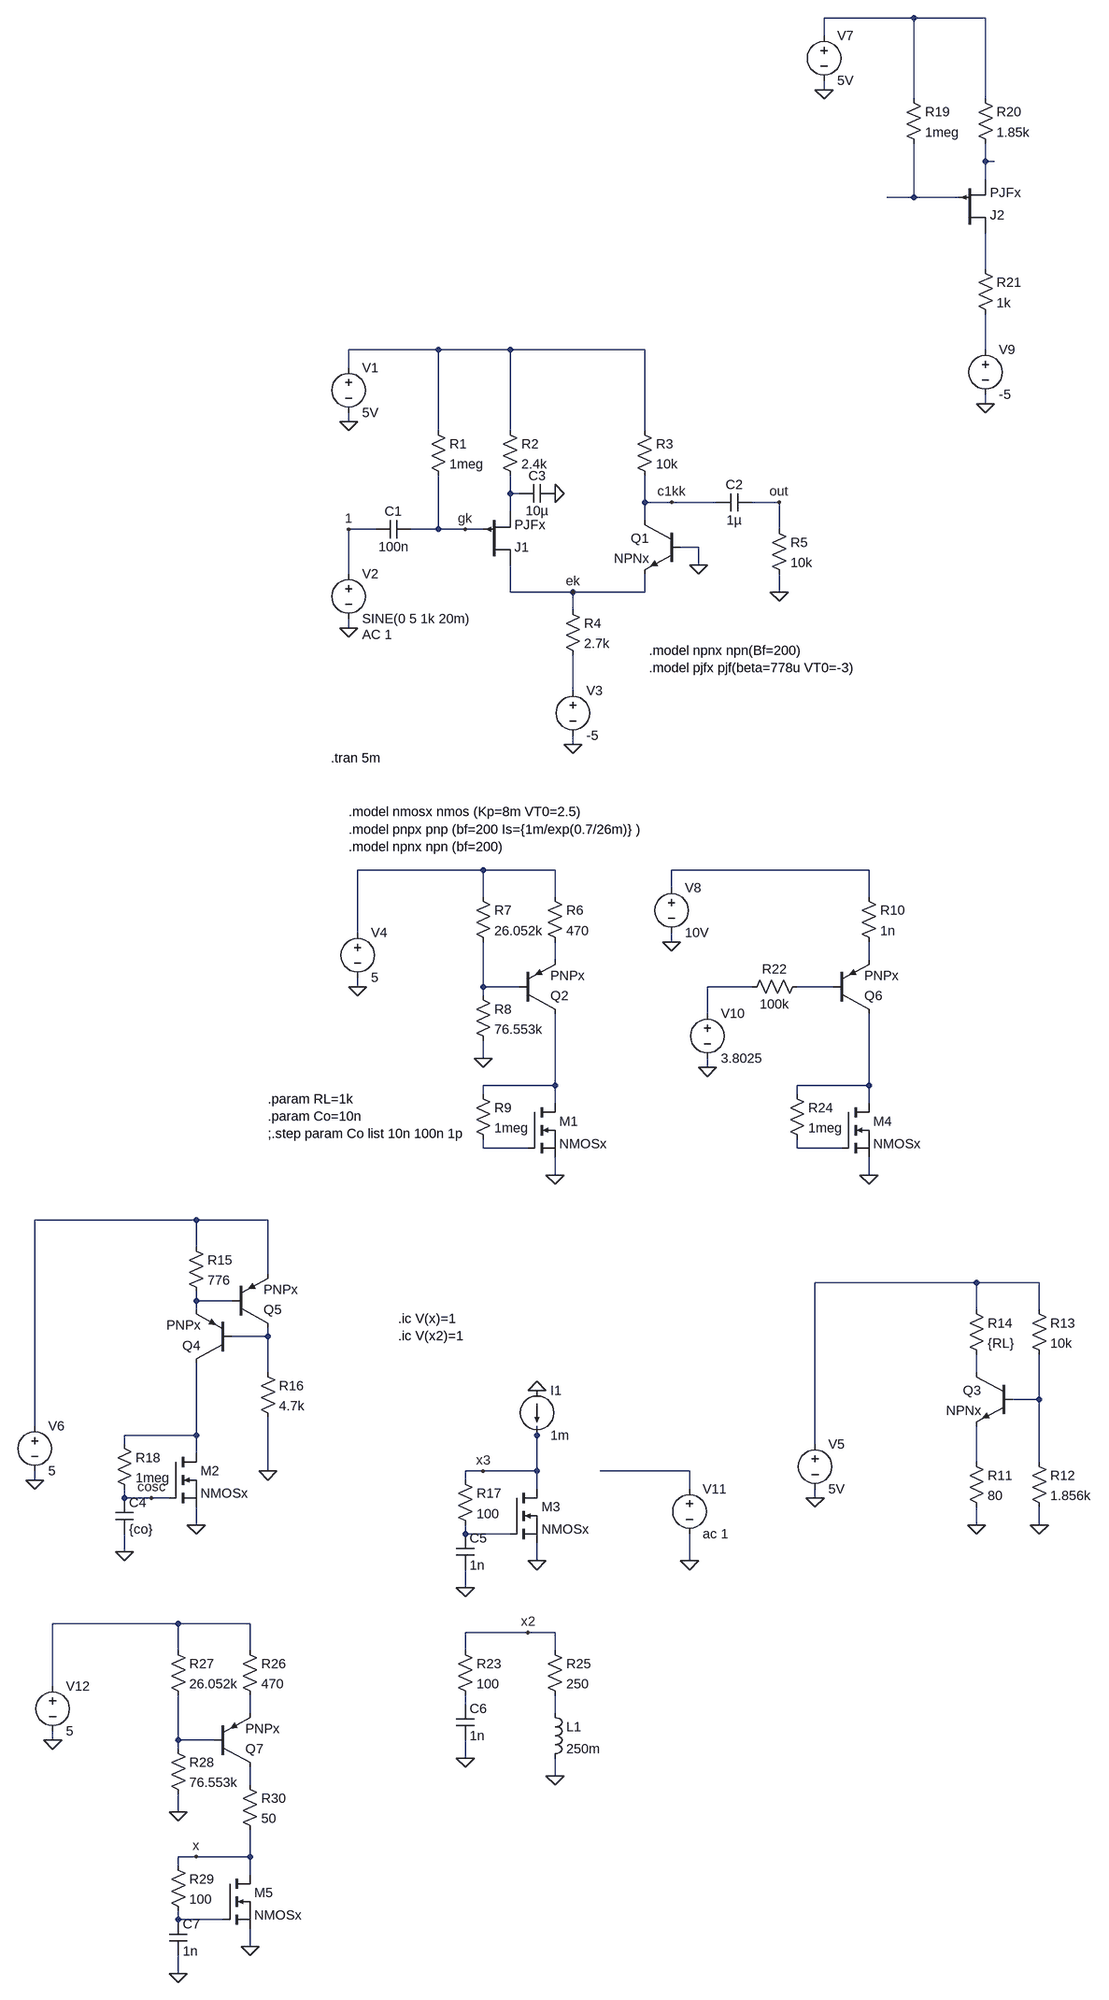
[diagram p0: schematic ws09_10.asc]
ws09_10.asc, the LTspice schematic file:
Version 4
SHEET 1 1320 2884
WIRE 976 -640 816 -640
WIRE 1104 -640 976 -640
WIRE 816 -608 816 -640
WIRE 816 -512 816 -528
WIRE 976 -496 976 -640
WIRE 1104 -496 1104 -640
WIRE 1104 -384 1104 -416
WIRE 1120 -384 1104 -384
WIRE 1104 -352 1104 -384
WIRE 976 -320 976 -416
WIRE 976 -320 928 -320
WIRE 1056 -320 976 -320
WIRE 1104 -192 1104 -256
WIRE 128 -48 -32 -48
WIRE 256 -48 128 -48
WIRE 496 -48 256 -48
WIRE 1104 -48 1104 -112
WIRE -32 -16 -32 -48
WIRE 1104 48 1104 32
WIRE -32 80 -32 64
WIRE 128 96 128 -48
WIRE 256 96 256 -48
WIRE 496 96 496 -48
WIRE 256 208 256 176
WIRE 272 208 256 208
WIRE 496 224 496 176
WIRE 544 224 496 224
WIRE 624 224 544 224
WIRE 736 224 688 224
WIRE 256 240 256 208
WIRE 496 256 496 224
WIRE 16 272 -32 272
WIRE 128 272 128 176
WIRE 128 272 80 272
WIRE 176 272 128 272
WIRE 208 272 176 272
WIRE 736 272 736 224
WIRE 592 304 560 304
WIRE 592 336 592 304
WIRE -32 352 -32 272
WIRE 256 384 256 336
WIRE 368 384 256 384
WIRE 496 384 496 352
WIRE 496 384 368 384
WIRE 736 384 736 352
WIRE 368 416 368 384
WIRE -32 448 -32 432
WIRE 368 560 368 496
WIRE 368 656 368 640
WIRE 208 880 -16 880
WIRE 336 880 208 880
WIRE 896 880 544 880
WIRE 544 912 544 880
WIRE 208 928 208 880
WIRE 336 928 336 880
WIRE 896 928 896 880
WIRE -16 992 -16 880
WIRE 544 1008 544 992
WIRE 336 1040 336 1008
WIRE 896 1040 896 1008
WIRE -16 1088 -16 1072
WIRE 208 1088 208 1008
WIRE 272 1088 208 1088
WIRE 688 1088 608 1088
WIRE 832 1088 768 1088
WIRE 208 1104 208 1088
WIRE 608 1136 608 1088
WIRE 208 1216 208 1184
WIRE 608 1232 608 1216
WIRE 336 1264 336 1136
WIRE 336 1264 208 1264
WIRE 896 1264 896 1136
WIRE 896 1264 768 1264
WIRE 208 1280 208 1264
WIRE 768 1280 768 1264
WIRE 336 1296 336 1264
WIRE 896 1296 896 1264
WIRE 208 1376 208 1360
WIRE 288 1376 208 1376
WIRE 768 1376 768 1360
WIRE 848 1376 768 1376
WIRE 336 1424 336 1392
WIRE 896 1424 896 1392
WIRE -304 1504 -592 1504
WIRE -176 1504 -304 1504
WIRE -304 1552 -304 1504
WIRE -176 1600 -176 1504
WIRE 1088 1616 800 1616
WIRE 1200 1616 1088 1616
WIRE -304 1648 -304 1632
WIRE -240 1648 -304 1648
WIRE -304 1664 -304 1648
WIRE 1088 1664 1088 1616
WIRE 1200 1664 1200 1616
WIRE -176 1712 -176 1696
WIRE -176 1712 -240 1712
WIRE -176 1776 -176 1712
WIRE 1088 1776 1088 1744
WIRE 1200 1824 1200 1744
WIRE 1200 1824 1152 1824
WIRE -592 1872 -592 1504
WIRE -304 1888 -304 1760
WIRE -304 1888 -432 1888
WIRE 304 1888 304 1872
WIRE -432 1904 -432 1888
WIRE 800 1904 800 1616
WIRE -304 1920 -304 1888
WIRE 1088 1936 1088 1872
WIRE 1200 1936 1200 1824
WIRE -176 1952 -176 1856
WIRE 208 1952 176 1952
WIRE 304 1952 304 1888
WIRE 304 1952 208 1952
WIRE 576 1952 416 1952
WIRE -592 1968 -592 1952
WIRE 176 1968 176 1952
WIRE 304 1984 304 1952
WIRE 576 1984 576 1952
WIRE -432 2000 -432 1984
WIRE -384 2000 -432 2000
WIRE -352 2000 -384 2000
WIRE 800 2000 800 1984
WIRE -304 2048 -304 2016
WIRE 1088 2048 1088 2016
WIRE 1200 2048 1200 2016
WIRE 176 2064 176 2048
WIRE 256 2064 176 2064
WIRE -432 2096 -432 2064
WIRE 304 2112 304 2080
WIRE 576 2112 576 2064
WIRE 176 2160 176 2128
WIRE -336 2224 -560 2224
WIRE -208 2224 -336 2224
WIRE 288 2240 176 2240
WIRE 336 2240 288 2240
WIRE -336 2272 -336 2224
WIRE -208 2272 -208 2224
WIRE 176 2272 176 2240
WIRE 336 2272 336 2240
WIRE -560 2336 -560 2224
WIRE 176 2368 176 2352
WIRE -208 2384 -208 2352
WIRE 336 2384 336 2352
WIRE -560 2432 -560 2416
WIRE -336 2432 -336 2352
WIRE -272 2432 -336 2432
WIRE -336 2448 -336 2432
WIRE 176 2464 176 2432
WIRE 336 2496 336 2464
WIRE -208 2512 -208 2480
WIRE -336 2560 -336 2528
WIRE -304 2640 -336 2640
WIRE -208 2640 -208 2592
WIRE -208 2640 -304 2640
WIRE -336 2656 -336 2640
WIRE -208 2672 -208 2640
WIRE -336 2752 -336 2736
WIRE -256 2752 -336 2752
WIRE -208 2800 -208 2768
WIRE -336 2848 -336 2816
FLAG -32 448 0
FLAG -32 80 0
FLAG 368 656 0
FLAG 736 384 0
FLAG 592 336 0
FLAG 336 208 0
FLAG 368 384 ek
FLAG 736 224 out
FLAG 176 272 gk
FLAG -32 272 1
FLAG -16 1088 0
FLAG 208 1216 0
FLAG 336 1424 0
FLAG 800 2000 0
FLAG 1088 2048 0
FLAG 1200 2048 0
FLAG -592 1968 0
FLAG -176 1952 0
FLAG -304 2048 0
FLAG -432 2096 0
FLAG 304 2112 0
FLAG 176 2160 0
FLAG 304 1808 0
FLAG -384 2000 cosc
FLAG 816 -512 0
FLAG 1104 48 0
FLAG 544 224 c1kk
FLAG 544 1008 0
FLAG 896 1424 0
FLAG 608 1232 0
FLAG 576 2112 0
FLAG 176 2464 0
FLAG 336 2496 0
FLAG 288 2240 x2
FLAG 208 1952 x3
FLAG -560 2432 0
FLAG -336 2560 0
FLAG -208 2800 0
FLAG -336 2848 0
FLAG -304 2640 x
SYMBOL voltage -32 -32 R0
SYMATTR InstName V1
SYMATTR Value 5V
SYMBOL voltage -32 336 R0
WINDOW 123 24 124 Left 2
WINDOW 39 0 0 Left 2
SYMATTR InstName V2
SYMATTR Value SINE(0 5 1k 20m)
SYMATTR Value2 AC 1
SYMBOL cap 80 256 R90
WINDOW 0 0 32 VBottom 2
WINDOW 3 32 32 VTop 2
SYMATTR InstName C1
SYMATTR Value 100n
SYMBOL res 112 80 R0
SYMATTR InstName R1
SYMATTR Value 1meg
SYMBOL res 240 80 R0
SYMATTR InstName R2
SYMATTR Value 2.4k
SYMBOL res 480 80 R0
SYMATTR InstName R3
SYMATTR Value 10k
SYMBOL res 352 400 R0
SYMATTR InstName R4
SYMATTR Value 2.7k
SYMBOL res 720 256 R0
SYMATTR InstName R5
SYMATTR Value 10k
SYMBOL pjf 208 336 M180
SYMATTR InstName J1
SYMATTR Value PJFx
SYMBOL npn 560 256 M0
SYMATTR InstName Q1
SYMATTR Value NPNx
SYMBOL voltage 368 544 R0
SYMATTR InstName V3
SYMATTR Value -5
SYMBOL cap 688 208 R90
WINDOW 0 0 32 VBottom 2
WINDOW 3 32 32 VTop 2
SYMATTR InstName C2
SYMATTR Value 1µ
SYMBOL cap 336 192 R90
WINDOW 0 0 32 VBottom 2
WINDOW 3 32 32 VTop 2
SYMATTR InstName C3
SYMATTR Value 10µ
SYMBOL pnp 272 1136 M180
SYMATTR InstName Q2
SYMATTR Value PNPx
SYMBOL res 320 912 R0
SYMATTR InstName R6
SYMATTR Value 470
SYMBOL res 192 912 R0
SYMATTR InstName R7
SYMATTR Value 26.052k
SYMBOL voltage -16 976 R0
WINDOW 123 0 0 Left 2
WINDOW 39 0 0 Left 2
SYMATTR InstName V4
SYMATTR Value 5
SYMBOL res 192 1088 R0
SYMATTR InstName R8
SYMATTR Value 76.553k
SYMBOL nmos 288 1296 R0
SYMATTR InstName M1
SYMATTR Value NMOSx
SYMBOL res 192 1264 R0
SYMATTR InstName R9
SYMATTR Value 1meg
SYMBOL voltage 800 1888 R0
SYMATTR InstName V5
SYMATTR Value 5V
SYMBOL npn 1152 1776 M0
SYMATTR InstName Q3
SYMATTR Value NPNx
SYMBOL res 1072 1920 R0
SYMATTR InstName R11
SYMATTR Value 80
SYMBOL res 1184 1920 R0
SYMATTR InstName R12
SYMATTR Value 1.856k
SYMBOL res 1184 1648 R0
SYMATTR InstName R13
SYMATTR Value 10k
SYMBOL res 1072 1648 R0
SYMATTR InstName R14
SYMATTR Value {RL}
SYMBOL voltage -592 1856 R0
WINDOW 123 0 0 Left 2
WINDOW 39 0 0 Left 2
SYMATTR InstName V6
SYMATTR Value 5
SYMBOL pnp -240 1760 R180
SYMATTR InstName Q4
SYMATTR Value PNPx
SYMBOL res -320 1536 R0
SYMATTR InstName R15
SYMATTR Value 776
SYMBOL res -192 1760 R0
SYMATTR InstName R16
SYMATTR Value 4.7k
SYMBOL pnp -240 1696 M180
SYMATTR InstName Q5
SYMATTR Value PNPx
SYMBOL nmos -352 1920 R0
SYMATTR InstName M2
SYMATTR Value NMOSx
SYMBOL res -448 1888 R0
SYMATTR InstName R18
SYMATTR Value 1meg
SYMBOL cap -448 2000 R0
SYMATTR InstName C4
SYMATTR Value {co}
SYMBOL nmos 256 1984 R0
SYMATTR InstName M3
SYMATTR Value NMOSx
SYMBOL res 160 1952 R0
SYMATTR InstName R17
SYMATTR Value 100
SYMBOL cap 160 2064 R0
SYMATTR InstName C5
SYMATTR Value 1n
SYMBOL current 304 1808 R0
WINDOW 123 0 0 Left 2
WINDOW 39 0 0 Left 2
SYMATTR InstName I1
SYMATTR Value 1m
SYMBOL voltage 816 -624 R0
SYMATTR InstName V7
SYMATTR Value 5V
SYMBOL res 960 -512 R0
SYMATTR InstName R19
SYMATTR Value 1meg
SYMBOL res 1088 -512 R0
SYMATTR InstName R20
SYMATTR Value 1.85k
SYMBOL res 1088 -208 R0
SYMATTR InstName R21
SYMATTR Value 1k
SYMBOL pjf 1056 -256 M180
SYMATTR InstName J2
SYMATTR Value PJFx
SYMBOL voltage 1104 -64 R0
SYMATTR InstName V9
SYMATTR Value -5
SYMBOL pnp 832 1136 M180
SYMATTR InstName Q6
SYMATTR Value PNPx
SYMBOL res 880 912 R0
SYMATTR InstName R10
SYMATTR Value 1n
SYMBOL voltage 544 896 R0
WINDOW 123 0 0 Left 2
WINDOW 39 0 0 Left 2
SYMATTR InstName V8
SYMATTR Value 10V
SYMBOL nmos 848 1296 R0
SYMATTR InstName M4
SYMATTR Value NMOSx
SYMBOL res 752 1264 R0
SYMATTR InstName R24
SYMATTR Value 1meg
SYMBOL res 784 1072 R90
WINDOW 0 0 56 VBottom 2
WINDOW 3 32 56 VTop 2
SYMATTR InstName R22
SYMATTR Value 100k
SYMBOL voltage 608 1120 R0
WINDOW 123 0 0 Left 2
WINDOW 39 0 0 Left 2
SYMATTR InstName V10
SYMATTR Value 3.8025
SYMBOL voltage 576 1968 R0
WINDOW 123 0 0 Left 2
WINDOW 39 0 0 Left 2
SYMATTR InstName V11
SYMATTR Value ac 1
SYMBOL res 160 2256 R0
SYMATTR InstName R23
SYMATTR Value 100
SYMBOL cap 160 2368 R0
SYMATTR InstName C6
SYMATTR Value 1n
SYMBOL res 320 2256 R0
SYMATTR InstName R25
SYMATTR Value 250
SYMBOL ind 320 2368 R0
SYMATTR InstName L1
SYMATTR Value 250m
SYMBOL pnp -272 2480 M180
SYMATTR InstName Q7
SYMATTR Value PNPx
SYMBOL res -224 2256 R0
SYMATTR InstName R26
SYMATTR Value 470
SYMBOL res -352 2256 R0
SYMATTR InstName R27
SYMATTR Value 26.052k
SYMBOL voltage -560 2320 R0
WINDOW 123 0 0 Left 2
WINDOW 39 0 0 Left 2
SYMATTR InstName V12
SYMATTR Value 5
SYMBOL res -352 2432 R0
SYMATTR InstName R28
SYMATTR Value 76.553k
SYMBOL nmos -256 2672 R0
SYMATTR InstName M5
SYMATTR Value NMOSx
SYMBOL res -352 2640 R0
SYMATTR InstName R29
SYMATTR Value 100
SYMBOL cap -352 2752 R0
SYMATTR InstName C7
SYMATTR Value 1n
SYMBOL res -224 2496 R0
SYMATTR InstName R30
SYMATTR Value 50
TEXT 504 488 Left 2 !.model npnx npn(Bf=200)\n.model pjfx pjf(beta=778u VT0=-3)
TEXT -64 680 Left 2 !.tran 5m
TEXT -32 776 Left 2 !.model nmosx nmos (Kp=8m VT0=2.5)\n.model pnpx pnp (bf=200 Is={1m/exp(0.7/26m)} )\n.model npnx npn (bf=200)
TEXT -176 1288 Left 2 !.param RL=1k\n.param Co=10n\n;.step param Co list 10n 100n 1p
TEXT 56 1680 Left 2 !.ic V(x)=1\n.ic V(x2)=1

The netlist it stands for:
* ws09_10.asc
V1 N005 0 5V
V2 1 0 SINE(0 5 1k 20m) AC 1
C1 gk 1 100n
R1 N005 gk 1meg
R2 N005 N007 2.4k
R3 N005 c1kk 10k
R4 ek N008 2.7k
R5 out 0 10k
J1 ek gk N007 PJFx
Q1 c1kk 0 ek 0 NPNx
V3 N008 0 -5
C2 out c1kk 1µ
C3 0 N007 10µ
Q2 N016 N013 N011 0 PNPx
R6 N009 N011 470
R7 N009 N013 26.052k
V4 N009 0 5
R8 N013 0 76.553k
M1 N016 N018 0 0 NMOSx
R9 N016 N018 1meg
V5 N021 0 5V
Q3 N024 N025 N027 0 NPNx
R11 N027 0 80
R12 N025 0 1.856k
R13 N021 N025 10k
R14 N021 N024 {RL}
V6 N020 0 5
Q4 N026 N023 N022 0 PNPx
R15 N020 N022 776
R16 N023 0 4.7k
Q5 N023 N022 N020 0 PNPx
M2 N026 cosc 0 0 NMOSx
R18 N026 cosc 1meg
C4 cosc 0 {co}
M3 x3 N029 0 0 NMOSx
R17 x3 N029 100
C5 N029 0 1n
I1 0 x3 1m
V7 N001 0 5V
R19 N001 N003 1meg
R20 N001 N002 1.85k
R21 N004 N006 1k
J2 N004 N003 N002 PJFx
V9 N006 0 -5
Q6 N017 N015 N012 0 PNPx
R10 N010 N012 1n
V8 N010 0 10V
M4 N017 N019 0 0 NMOSx
R24 N017 N019 1meg
R22 N015 N014 100k
V10 N014 0 3.8025
V11 N028 0 ac 1
R23 x2 N031 100
C6 N031 0 1n
R25 x2 N033 250
L1 N033 0 250m
Q7 N035 N034 N032 0 PNPx
R26 N030 N032 470
R27 N030 N034 26.052k
V12 N030 0 5
R28 N034 0 76.553k
M5 x N036 0 0 NMOSx
R29 x N036 100
C7 N036 0 1n
R30 N035 x 50
.model NPN NPN
.model PNP PNP
.lib standard.bjt
.model NJF NJF
.model PJF PJF
.lib standard.jft
.model NMOS NMOS
.model PMOS PMOS
.lib standard.mos
.model npnx npn(Bf=200)
.model pjfx pjf(beta=778u VT0=-3)
.tran 5m
.model nmosx nmos (Kp=8m VT0=2.5)
.model pnpx pnp (bf=200 Is={1m/exp(0.7/26m)} )
.model npnx npn (bf=200)
.param RL=1k
.param Co=10n
;.step param Co list 10n 100n 1p
.ic V(x)=1
.ic V(x2)=1
.backanno
.end